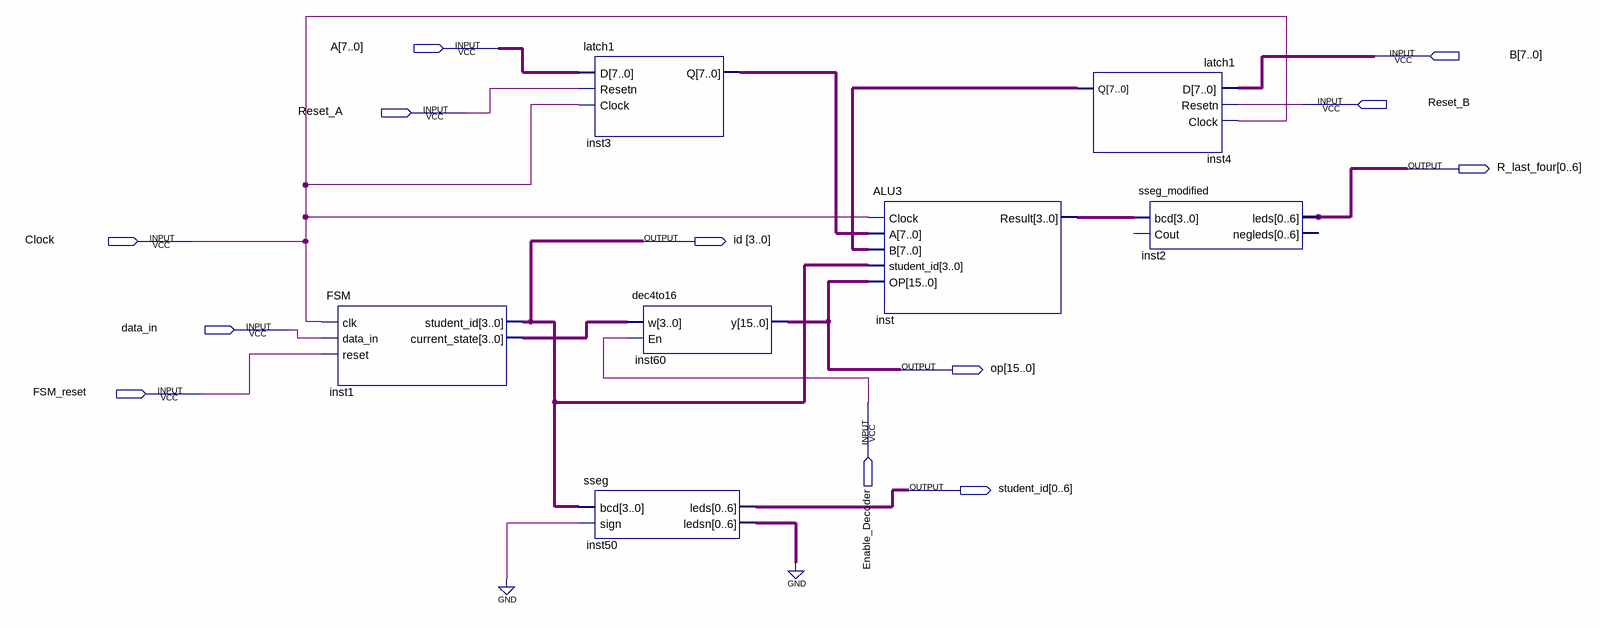
[diagram p0: schematic sheet]
// Quartus schematic Problem3.bdf as structural Verilog: 7 symbols, 12 pins
module Problem3 (
  input  [7:0] A,
  input  [7:0] B,
  input  Reset_B,
  input  Reset_A,
  input  Clock,
  input  data_in,
  input  FSM_reset,
  input  Enable_Decoder,
  output [0:6] R_last_four,
  output [3:0] id,
  output [15:0] op,
  output [0:6] student_id
);

  wire [3:0] inst1_current_state, inst_result;
  wire [6:0] inst50_ledsn;
  wire [7:0] inst3_q, inst4_q;

  FSM inst1 (.clk(Clock), .data_in(data_in), .reset(FSM_reset), .student_id(id), .current_state(inst1_current_state));
  latch1 inst3 (.D(A), .Resetn(Reset_A), .Clock(Clock), .Q(inst3_q));
  dec4to16 inst60 (.w(inst1_current_state), .En(Enable_Decoder), .y(op));
  sseg inst50 (.bcd(id), .sign(1'b0), .leds(student_id), .ledsn(inst50_ledsn));
  ALU3 inst (.Clock(Clock), .A(inst3_q), .B(inst4_q), .student_id(id), .OP(op), .Result(inst_result));
  latch1 inst4 (.D(B), .Resetn(Reset_B), .Clock(Clock), .Q(inst4_q));
  sseg_modified inst2 (.bcd(inst_result), .leds(R_last_four));  // open: Cout, negleds
  // also tied to GND on the sheet: {inst50_ledsn[0], inst50_ledsn[1], inst50_ledsn[2], inst50_ledsn[3], inst50_ledsn[4], inst50_ledsn[5], inst50_ledsn[6]}
endmodule
